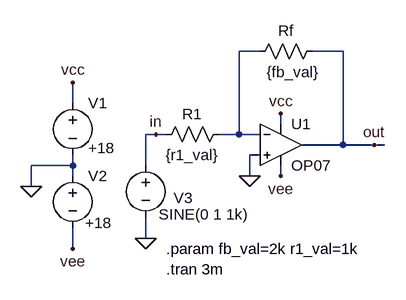
[diagram p0: schematic 05-invertin_amplifier.asc]
05-invertin_amplifier.asc, the LTspice schematic file:
Version 4
SHEET 1 880 680
WIRE 160 -64 128 -64
WIRE 288 -64 240 -64
WIRE -128 16 -128 -16
WIRE 192 48 192 32
WIRE 0 64 -16 64
WIRE 16 64 0 64
WIRE 128 64 128 -64
WIRE 128 64 96 64
WIRE 160 64 128 64
WIRE 288 80 288 -64
WIRE 288 80 224 80
WIRE 336 80 288 80
WIRE 352 80 336 80
WIRE 160 96 144 96
WIRE -128 112 -128 96
WIRE -128 112 -192 112
WIRE -16 112 -16 64
WIRE -128 128 -128 112
WIRE 144 128 144 96
WIRE 192 128 192 112
WIRE -192 144 -192 112
WIRE -16 224 -16 192
WIRE -128 240 -128 208
FLAG -192 144 0
FLAG -128 -16 vcc
FLAG -128 240 vee
FLAG -16 224 0
FLAG 0 64 in
FLAG 192 128 vee
FLAG 192 32 vcc
FLAG 336 80 out
FLAG 144 128 0
SYMBOL OpAmps\\OP07 192 16 R0
SYMATTR InstName U1
SYMBOL voltage -128 0 R0
WINDOW 3 24 85 Left 2
WINDOW 123 0 0 Left 0
WINDOW 39 0 0 Left 0
SYMATTR InstName V1
SYMATTR Value +18
SYMBOL voltage -128 112 R0
WINDOW 3 19 88 Left 2
WINDOW 123 0 0 Left 0
WINDOW 39 0 0 Left 0
SYMATTR InstName V2
SYMATTR Value +18
SYMBOL voltage -16 96 R0
WINDOW 0 43 66 Left 2
WINDOW 3 20 91 Left 2
WINDOW 123 0 0 Left 0
WINDOW 39 0 0 Left 0
SYMATTR InstName V3
SYMATTR Value SINE(0 1 1k)
SYMBOL res 256 -80 R90
WINDOW 0 0 56 VBottom 2
WINDOW 3 32 45 VTop 2
SYMATTR InstName Rf
SYMATTR Value {fb_val}
SYMBOL res 112 48 R90
WINDOW 0 0 56 VBottom 2
WINDOW 3 32 56 VTop 2
SYMATTR InstName R1
SYMATTR Value {r1_val}
TEXT 16 240 Left 2 !.param fb_val=2k r1_val=1k
TEXT 16 272 Left 2 !.tran 3m

The netlist it stands for:
* 05-invertin_amplifier.asc
XU1 0 N001 vcc vee out LT1001  ; OP07, pins In+ In- V+ V- OUT
V1 vcc 0 +18
V2 0 vee +18
V3 in 0 SINE(0 1 1k)
Rf out N001 {fb_val}
R1 N001 in {r1_val}
.param fb_val=2k r1_val=1k
.tran 3m
.lib LTC.lib
.backanno
.end